# EasyEDA schematic 1-Schematic_BIG MODULE.json
TITLE: Sheet_1; REV: 1.0; Date: 2020-03-20; Sheet: 1/1; Drawn By: baddy227; Company: Your Company
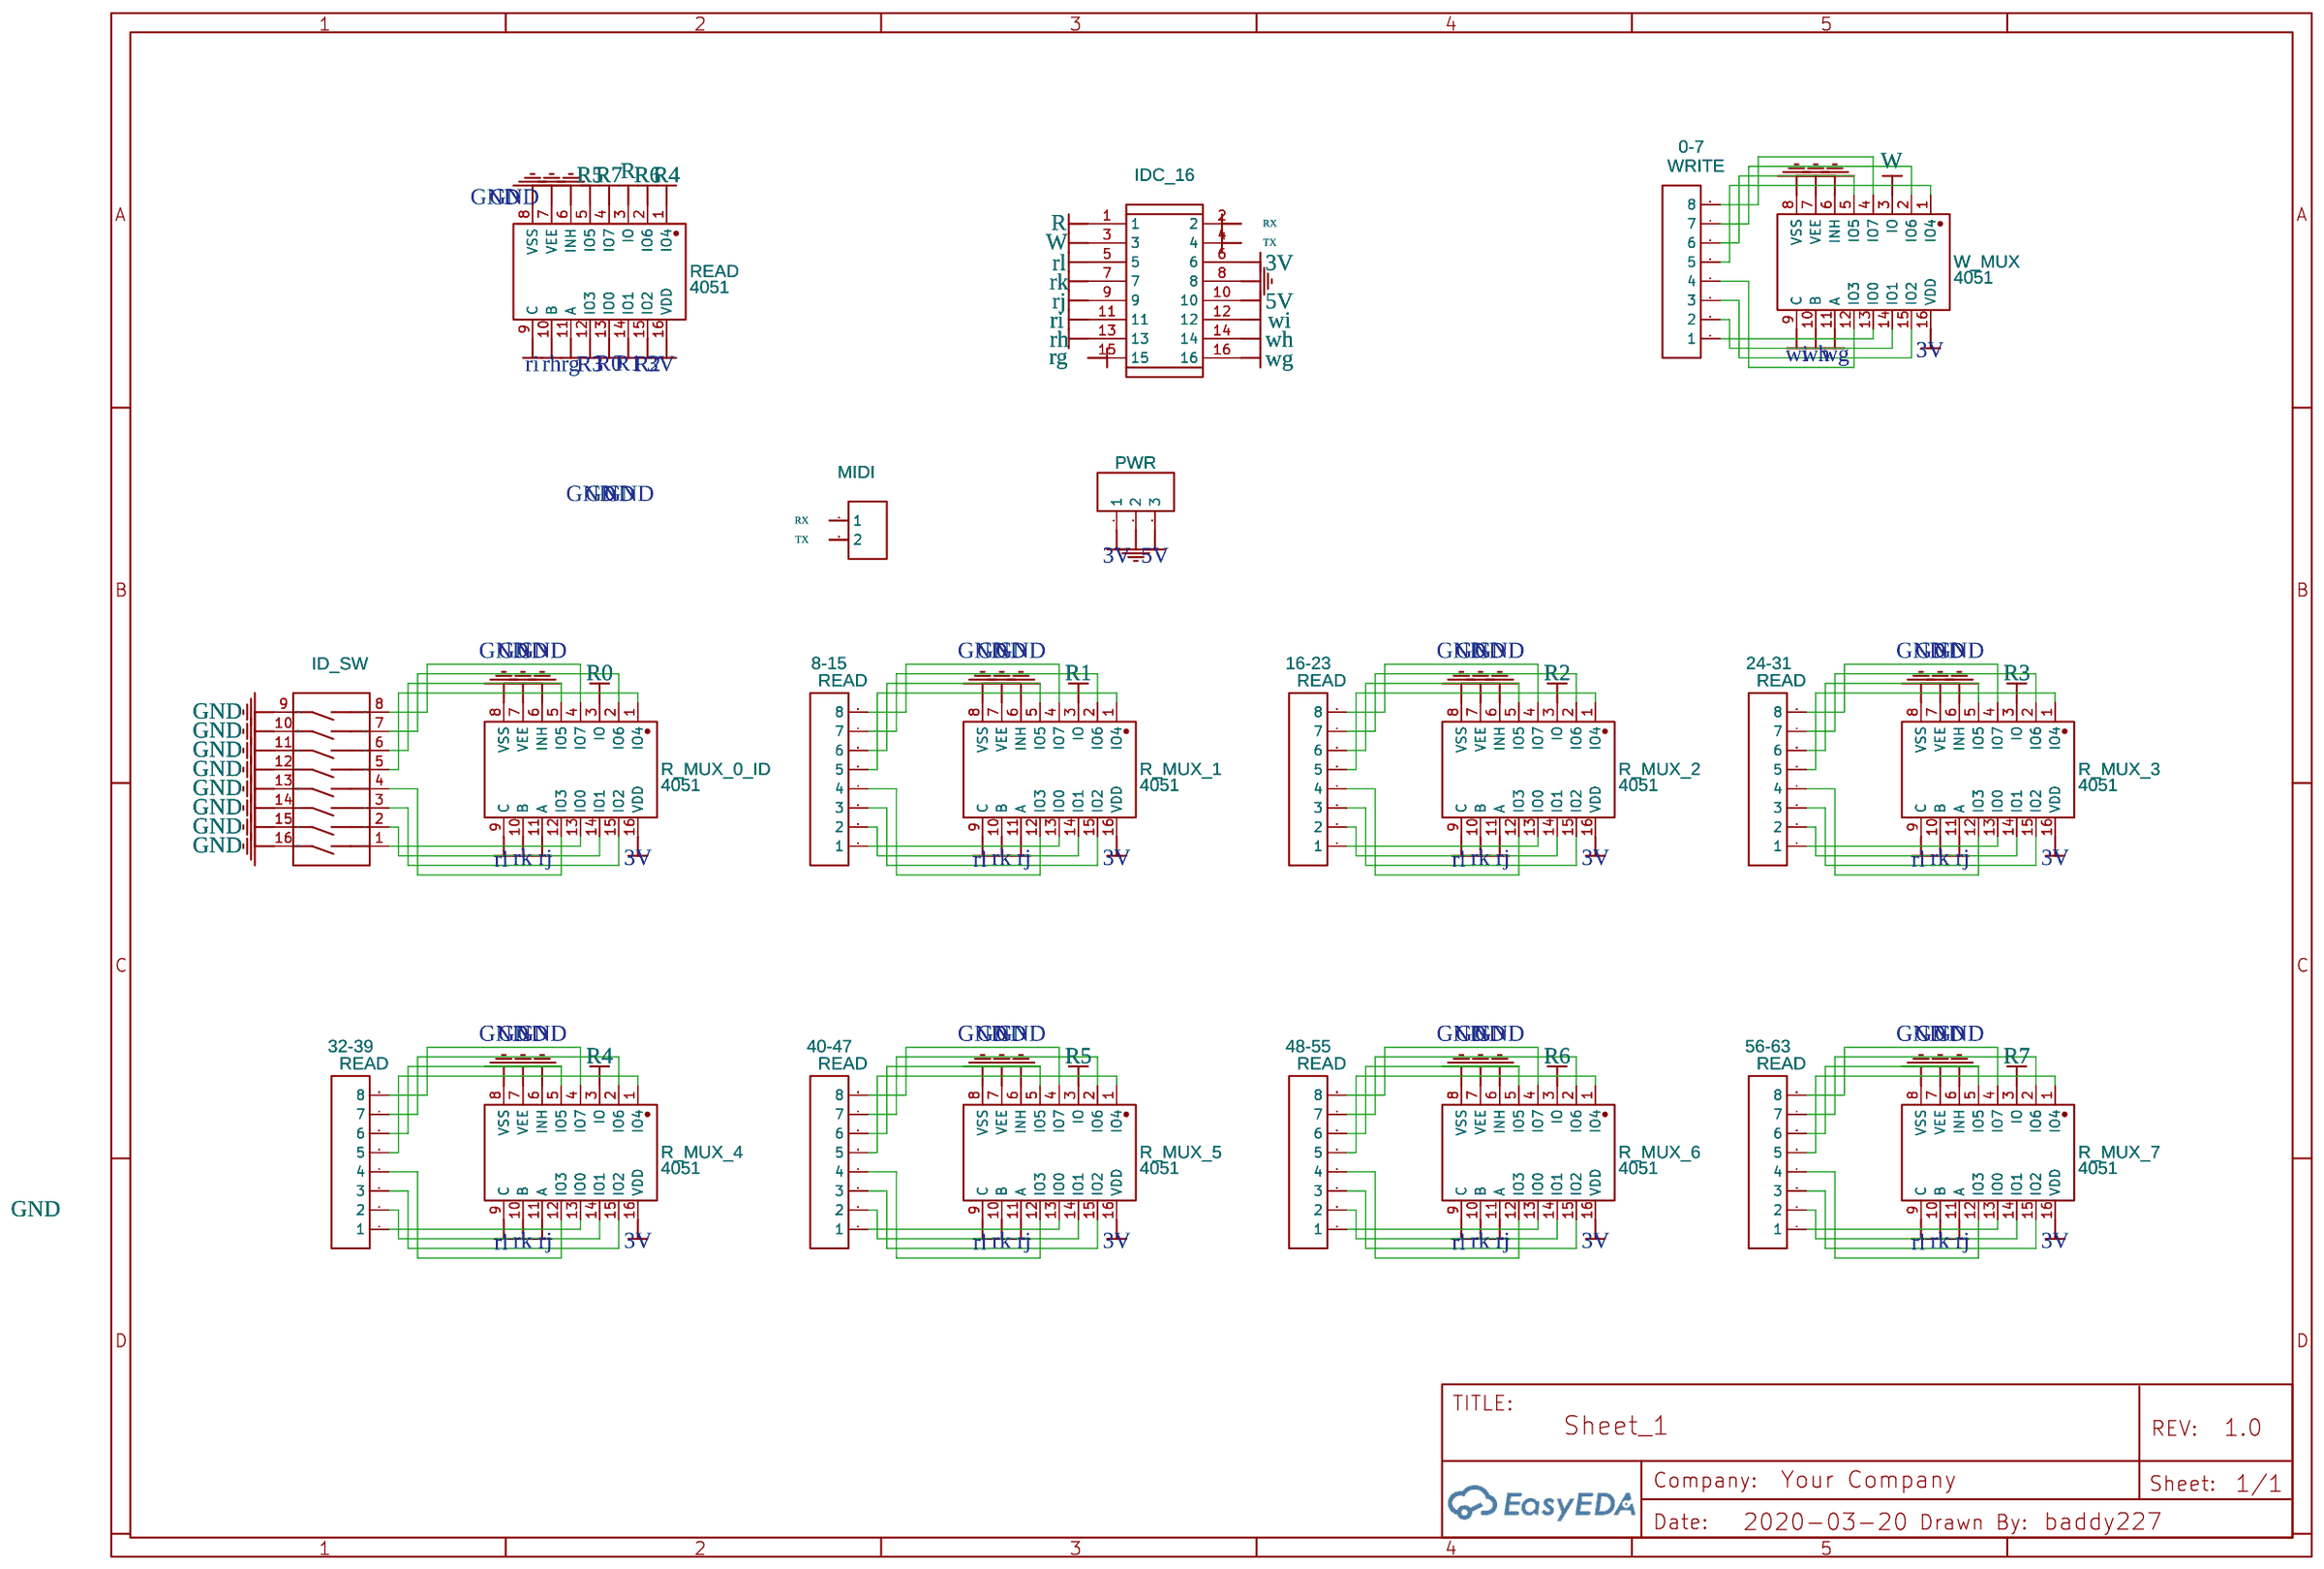
[diagram p0: schematic sheet]

## Parts
8-15  READ  [HDR-8X1/2.54]
16-23  READ  [HDR-8X1/2.54]
24-31  READ  [HDR-8X1/2.54]
32-39  READ  [HDR-8X1/2.54]
40-47  READ  [HDR-8X1/2.54]
48-55  READ  [HDR-8X1/2.54]
56-63  READ  [HDR-8X1/2.54]
ID_SW  DIP switchEI-08  [SW-TH_16P-L20.5-W6.0-P2.54]
IDC_16  IDC Box 2X8 2.54MM  [CONN-TH_16P-P2.54_C9142]
MIDI  HDR-M-2.54_1x2  [HDR-M-2.54_1X2]
PWR  Header-Male-2.54_1x3  [HDR-TH_3P-P2.54-V]
R_MUX_0_ID  4051  [DIP-16_L20.0-W6.4-P2.54-LS7.6-BL]
R_MUX_1  4051  [DIP-16_L20.0-W6.4-P2.54-LS7.6-BL]
R_MUX_2  4051  [DIP-16_L20.0-W6.4-P2.54-LS7.6-BL]
R_MUX_3  4051  [DIP-16_L20.0-W6.4-P2.54-LS7.6-BL]
R_MUX_4  4051  [DIP-16_L20.0-W6.4-P2.54-LS7.6-BL]
R_MUX_5  4051  [DIP-16_L20.0-W6.4-P2.54-LS7.6-BL]
R_MUX_6  4051  [DIP-16_L20.0-W6.4-P2.54-LS7.6-BL]
R_MUX_7  4051  [DIP-16_L20.0-W6.4-P2.54-LS7.6-BL]
READ  4051  [DIP-16_L20.0-W6.4-P2.54-LS7.6-BL]
W_MUX  4051  [DIP-16_L20.0-W6.4-P2.54-LS7.6-BL]
WRITE  0-7  [HDR-8X1/2.54]

## Library data of the parts
8-15 16-23 24-31 32-39 40-47 48-55 56-63 = Header-Female-2.54_1x8: Supplier: LCSC; Manufacturer: BOOMELE; Manufacturer Part: Female headerHDR1X8-2.54; Supplier Part: C27438
ID_SW = DIP switchEI-08: Supplier: LCSC; Manufacturer: DIP; Supplier Part: C90019
IDC_16 = IDC Box 2X8 2.54MM: Supplier: LCSC; Manufacturer: BOOMELE; image: //image.lceda.cn/szlcsc/C9142.jpg; Supplier Part: C9142
MIDI = HDR-M-2.54_1x2: Supplier Part: C124375; Supplier: LCSC; Contributor: LCEDA_Lib
PWR = Header-Male-2.54_1x3: Supplier: LCSC; Manufacturer: BOOMELE; Manufacturer Part: Header2.54mm 1*3P; image: //image.lceda.cn/szlcsc/C49257.jpg; Supplier Part: C49257
R_MUX_0_ID R_MUX_1-R_MUX_7 READ W_MUX = CD4051BE: Supplier: LCSC; Manufacturer: TI; image: //image.lceda.cn/szlcsc/C5200.jpg; Supplier Part: C5200
WRITE = Header-Female-2.54_1x8: Supplier: LCSC; Manufacturer: BOOMELE; Manufacturer Part: Female headerHDR1X8-2.54; Supplier Part: C27438; Package Display: No

## Nets
3V: IDC_16.6 PWR.1 R_MUX_0_ID.16(VDD) R_MUX_1.16(VDD) R_MUX_2.16(VDD) R_MUX_3.16(VDD) R_MUX_4.16(VDD) R_MUX_5.16(VDD) R_MUX_6.16(VDD) R_MUX_7.16(VDD) READ.16(VDD) W_MUX.16(VDD)
5V: IDC_16.10 PWR.3
GND: ID_SW.9 ID_SW.10 ID_SW.11 ID_SW.12 ID_SW.13 ID_SW.14 ID_SW.15 ID_SW.16 IDC_16.8 PWR.2 R_MUX_0_ID.6(INH) R_MUX_0_ID.7(VEE) R_MUX_0_ID.8(VSS) R_MUX_1.6(INH) R_MUX_1.7(VEE) R_MUX_1.8(VSS) R_MUX_2.6(INH) R_MUX_2.7(VEE) R_MUX_2.8(VSS) R_MUX_3.6(INH) R_MUX_3.7(VEE) R_MUX_3.8(VSS) R_MUX_4.6(INH) R_MUX_4.7(VEE) R_MUX_4.8(VSS) R_MUX_5.6(INH) R_MUX_5.7(VEE) R_MUX_5.8(VSS) R_MUX_6.6(INH) R_MUX_6.7(VEE) R_MUX_6.8(VSS) R_MUX_7.6(INH) R_MUX_7.7(VEE) R_MUX_7.8(VSS) READ.6(INH) READ.7(VEE) READ.8(VSS) W_MUX.6(INH) W_MUX.7(VEE) W_MUX.8(VSS)
R: IDC_16.1 READ.3(IO)
R0: R_MUX_0_ID.3(IO) READ.13(IO0)
R1: R_MUX_1.3(IO) READ.14(IO1)
R2: R_MUX_2.3(IO) READ.15(IO2)
R3: R_MUX_3.3(IO) READ.12(IO3)
R4: R_MUX_4.3(IO) READ.1(IO4)
R5: R_MUX_5.3(IO) READ.5(IO5)
R6: R_MUX_6.3(IO) READ.2(IO6)
R7: R_MUX_7.3(IO) READ.4(IO7)
rg: IDC_16.15 READ.11(A)
rh: IDC_16.13 READ.10(B)
ri: IDC_16.11 READ.9(C)
rj: IDC_16.9 R_MUX_0_ID.11(A) R_MUX_1.11(A) R_MUX_2.11(A) R_MUX_3.11(A) R_MUX_4.11(A) R_MUX_5.11(A) R_MUX_6.11(A) R_MUX_7.11(A)
rk: IDC_16.7 R_MUX_0_ID.10(B) R_MUX_1.10(B) R_MUX_2.10(B) R_MUX_3.10(B) R_MUX_4.10(B) R_MUX_5.10(B) R_MUX_6.10(B) R_MUX_7.10(B)
rl: IDC_16.5 R_MUX_0_ID.9(C) R_MUX_1.9(C) R_MUX_2.9(C) R_MUX_3.9(C) R_MUX_4.9(C) R_MUX_5.9(C) R_MUX_6.9(C) R_MUX_7.9(C)
RX: IDC_16.2 MIDI.1
TX: IDC_16.4 MIDI.2
W: IDC_16.3 W_MUX.3(IO)
wg: IDC_16.16 W_MUX.11(A)
wh: IDC_16.14 W_MUX.10(B)
wi: IDC_16.12 W_MUX.9(C)
Net-(8-15-1): 8-15.1 R_MUX_1.13(IO0)
Net-(8-15-2): 8-15.2 R_MUX_1.14(IO1)
Net-(8-15-3): 8-15.3 R_MUX_1.15(IO2)
Net-(8-15-4): 8-15.4 R_MUX_1.12(IO3)
Net-(8-15-5): 8-15.5 R_MUX_1.1(IO4)
Net-(8-15-6): 8-15.6 R_MUX_1.5(IO5)
Net-(8-15-7): 8-15.7 R_MUX_1.2(IO6)
Net-(8-15-8): 8-15.8 R_MUX_1.4(IO7)
Net-(16-23-1): 16-23.1 R_MUX_2.13(IO0)
Net-(16-23-2): 16-23.2 R_MUX_2.14(IO1)
Net-(16-23-3): 16-23.3 R_MUX_2.15(IO2)
Net-(16-23-4): 16-23.4 R_MUX_2.12(IO3)
Net-(16-23-5): 16-23.5 R_MUX_2.1(IO4)
Net-(16-23-6): 16-23.6 R_MUX_2.5(IO5)
Net-(16-23-7): 16-23.7 R_MUX_2.2(IO6)
Net-(16-23-8): 16-23.8 R_MUX_2.4(IO7)
Net-(24-31-1): 24-31.1 R_MUX_3.13(IO0)
Net-(24-31-2): 24-31.2 R_MUX_3.14(IO1)
Net-(24-31-3): 24-31.3 R_MUX_3.15(IO2)
Net-(24-31-4): 24-31.4 R_MUX_3.12(IO3)
Net-(24-31-5): 24-31.5 R_MUX_3.1(IO4)
Net-(24-31-6): 24-31.6 R_MUX_3.5(IO5)
Net-(24-31-7): 24-31.7 R_MUX_3.2(IO6)
Net-(24-31-8): 24-31.8 R_MUX_3.4(IO7)
Net-(32-39-1): 32-39.1 R_MUX_4.13(IO0)
Net-(32-39-2): 32-39.2 R_MUX_4.14(IO1)
Net-(32-39-3): 32-39.3 R_MUX_4.15(IO2)
Net-(32-39-4): 32-39.4 R_MUX_4.12(IO3)
Net-(32-39-5): 32-39.5 R_MUX_4.1(IO4)
Net-(32-39-6): 32-39.6 R_MUX_4.5(IO5)
Net-(32-39-7): 32-39.7 R_MUX_4.2(IO6)
Net-(32-39-8): 32-39.8 R_MUX_4.4(IO7)
Net-(40-47-1): 40-47.1 R_MUX_5.13(IO0)
Net-(40-47-2): 40-47.2 R_MUX_5.14(IO1)
Net-(40-47-3): 40-47.3 R_MUX_5.15(IO2)
Net-(40-47-4): 40-47.4 R_MUX_5.12(IO3)
Net-(40-47-5): 40-47.5 R_MUX_5.1(IO4)
Net-(40-47-6): 40-47.6 R_MUX_5.5(IO5)
Net-(40-47-7): 40-47.7 R_MUX_5.2(IO6)
Net-(40-47-8): 40-47.8 R_MUX_5.4(IO7)
Net-(48-55-1): 48-55.1 R_MUX_6.13(IO0)
Net-(48-55-2): 48-55.2 R_MUX_6.14(IO1)
Net-(48-55-3): 48-55.3 R_MUX_6.15(IO2)
Net-(48-55-4): 48-55.4 R_MUX_6.12(IO3)
Net-(48-55-5): 48-55.5 R_MUX_6.1(IO4)
Net-(48-55-6): 48-55.6 R_MUX_6.5(IO5)
Net-(48-55-7): 48-55.7 R_MUX_6.2(IO6)
Net-(48-55-8): 48-55.8 R_MUX_6.4(IO7)
Net-(56-63-1): 56-63.1 R_MUX_7.13(IO0)
Net-(56-63-2): 56-63.2 R_MUX_7.14(IO1)
Net-(56-63-3): 56-63.3 R_MUX_7.15(IO2)
Net-(56-63-4): 56-63.4 R_MUX_7.12(IO3)
Net-(56-63-5): 56-63.5 R_MUX_7.1(IO4)
Net-(56-63-6): 56-63.6 R_MUX_7.5(IO5)
Net-(56-63-7): 56-63.7 R_MUX_7.2(IO6)
Net-(56-63-8): 56-63.8 R_MUX_7.4(IO7)
Net-(ID_SW-1): ID_SW.1 R_MUX_0_ID.13(IO0)
Net-(ID_SW-2): ID_SW.2 R_MUX_0_ID.14(IO1)
Net-(ID_SW-3): ID_SW.3 R_MUX_0_ID.15(IO2)
Net-(ID_SW-4): ID_SW.4 R_MUX_0_ID.12(IO3)
Net-(ID_SW-5): ID_SW.5 R_MUX_0_ID.1(IO4)
Net-(ID_SW-6): ID_SW.6 R_MUX_0_ID.5(IO5)
Net-(ID_SW-7): ID_SW.7 R_MUX_0_ID.2(IO6)
Net-(ID_SW-8): ID_SW.8 R_MUX_0_ID.4(IO7)
Net-(W_MUX-1): W_MUX.1(IO4) WRITE.5
Net-(W_MUX-2): W_MUX.2(IO6) WRITE.7
Net-(W_MUX-4): W_MUX.4(IO7) WRITE.8
Net-(W_MUX-5): W_MUX.5(IO5) WRITE.6
Net-(W_MUX-12): W_MUX.12(IO3) WRITE.4
Net-(W_MUX-13): W_MUX.13(IO0) WRITE.1
Net-(W_MUX-14): W_MUX.14(IO1) WRITE.2
Net-(W_MUX-15): W_MUX.15(IO2) WRITE.3
